# EAGLE design INV_1_0 (EAGLE 8.3.2)
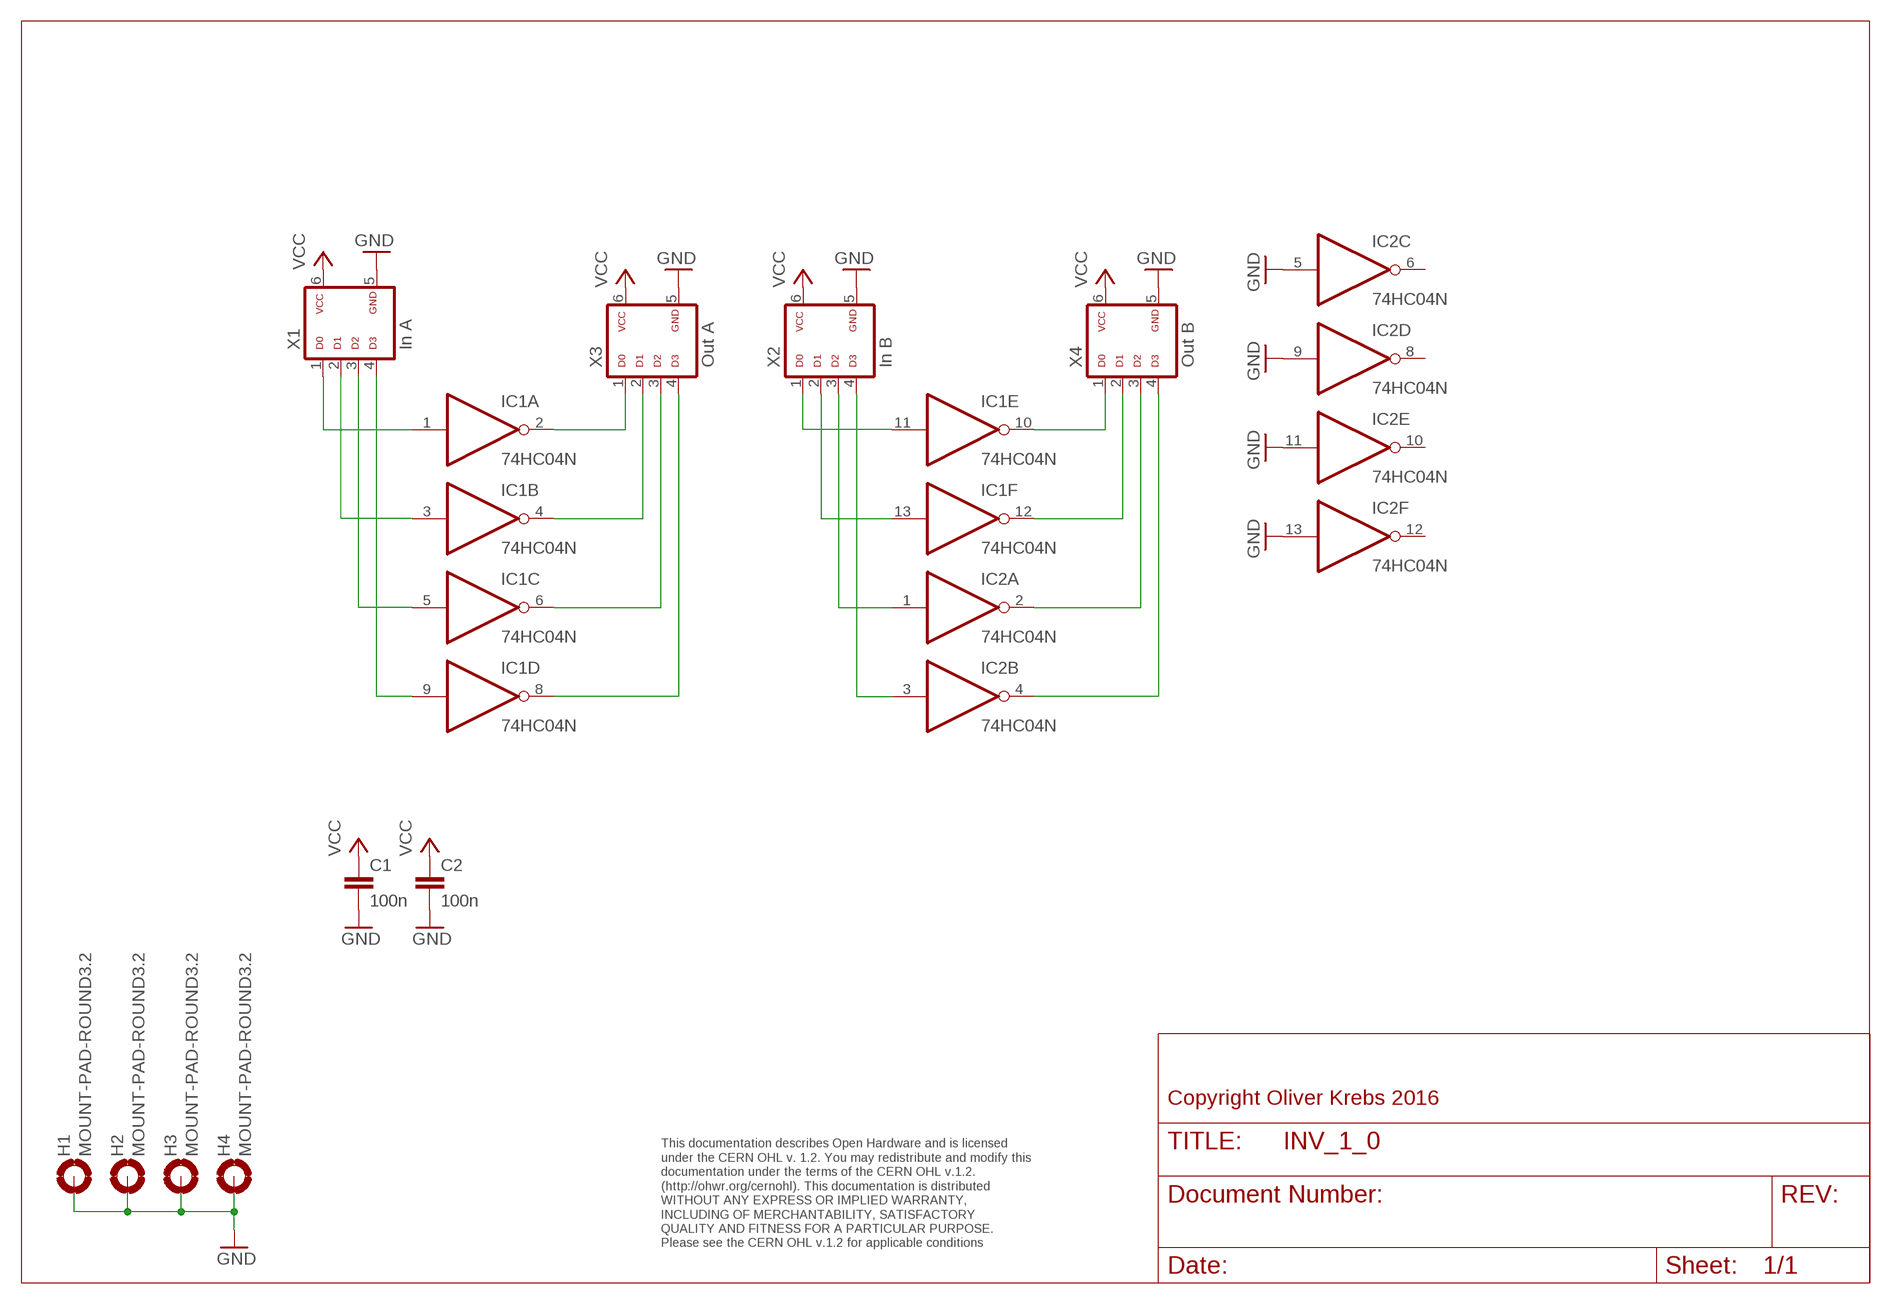
[diagram p0: schematic, sheet 1]

## Parts
C1  100n  C-EU050-025X075  [C050-025X075]
C2  100n  C-EU050-025X075  [C050-025X075]
H1  MOUNT-PAD-ROUND3.2  [3,2-PAD]
H2  MOUNT-PAD-ROUND3.2  [3,2-PAD]
H3  MOUNT-PAD-ROUND3.2  [3,2-PAD]
H4  MOUNT-PAD-ROUND3.2  [3,2-PAD]
IC1  74HC04N  [DIL14]
IC2  74HC04N  [DIL14]
X1  In A  ML6D  [ML-6]
X2  In B  ML6D  [ML-6]
X3  Out A  ML6D  [ML-6]
X4  Out B  ML6D  [ML-6]

## Nets
GND: C1.2 C2.2 H1.B3,2(MOUNT) H2.B3,2(MOUNT) H3.B3,2(MOUNT) H4.B3,2(MOUNT) IC2.5(C:I) IC2.9(D:I) IC2.11(E:I) IC2.13(F:I) X1.5 X2.5 X3.5 X4.5
N$4: IC1.8(D:O) X3.4
N$5: IC1.10(E:O) X4.1
N$6: IC1.12(F:O) X4.2
N$7: IC2.2(A:O) X4.3
N$8: IC2.4(B:O) X4.4
N$9: IC1.1(A:I) X1.1
N$10: IC1.11(E:I) X2.1
N$11: IC1.13(F:I) X2.2
N$12: IC1.3(B:I) X1.2
N$13: IC1.5(C:I) X1.3
N$14: IC2.1(A:I) X2.3
N$15: IC1.9(D:I) X1.4
N$16: IC2.3(B:I) X2.4
N$17: IC1.2(A:O) X3.1
N$18: IC1.4(B:O) X3.2
N$19: IC1.6(C:O) X3.3
VCC: C1.1 C2.1 X1.6 X2.6 X3.6 X4.6
Unconnected: IC2.6(C:O) IC2.8(D:O) IC2.10(E:O) IC2.12(F:O)

## Notes on the sheet
- Copyright Oliver Krebs 2016
- This documentation describes Open Hardware and is licensed 
  under the CERN OHL v. 1.2. You may redistribute and modify this 
  documentation under the terms of the CERN OHL v.1.2. 
  (http://ohwr.org/cernohl). This documentation is distributed
  WITHOUT ANY EXPRESS OR IMPLIED WARRANTY, 
  INCLUDING OF MERCHANTABILITY, SATISFACTORY 
  QUALITY AND FITNESS FOR A PARTICULAR PURPOSE. 
  Please see the CERN OHL v.1.2 for applicable conditions

## Power pins joined to a net without a drawn wire
GND: IC1.7(P:GND) IC2.7(P:GND)
VCC: IC1.14(P:VCC) IC2.14(P:VCC)

## Library data of the parts
C1 C2 = 01-my_rcl:C-EU: CAPACITOR, European symbol
H1-H4 = holes:MOUNT-PAD-ROUND: MOUNTING PAD, round
IC1 IC2 = 74xx-eu:74*04: Hex INVERTER
X1-X4 = 01-my-con:ML6D

## Board
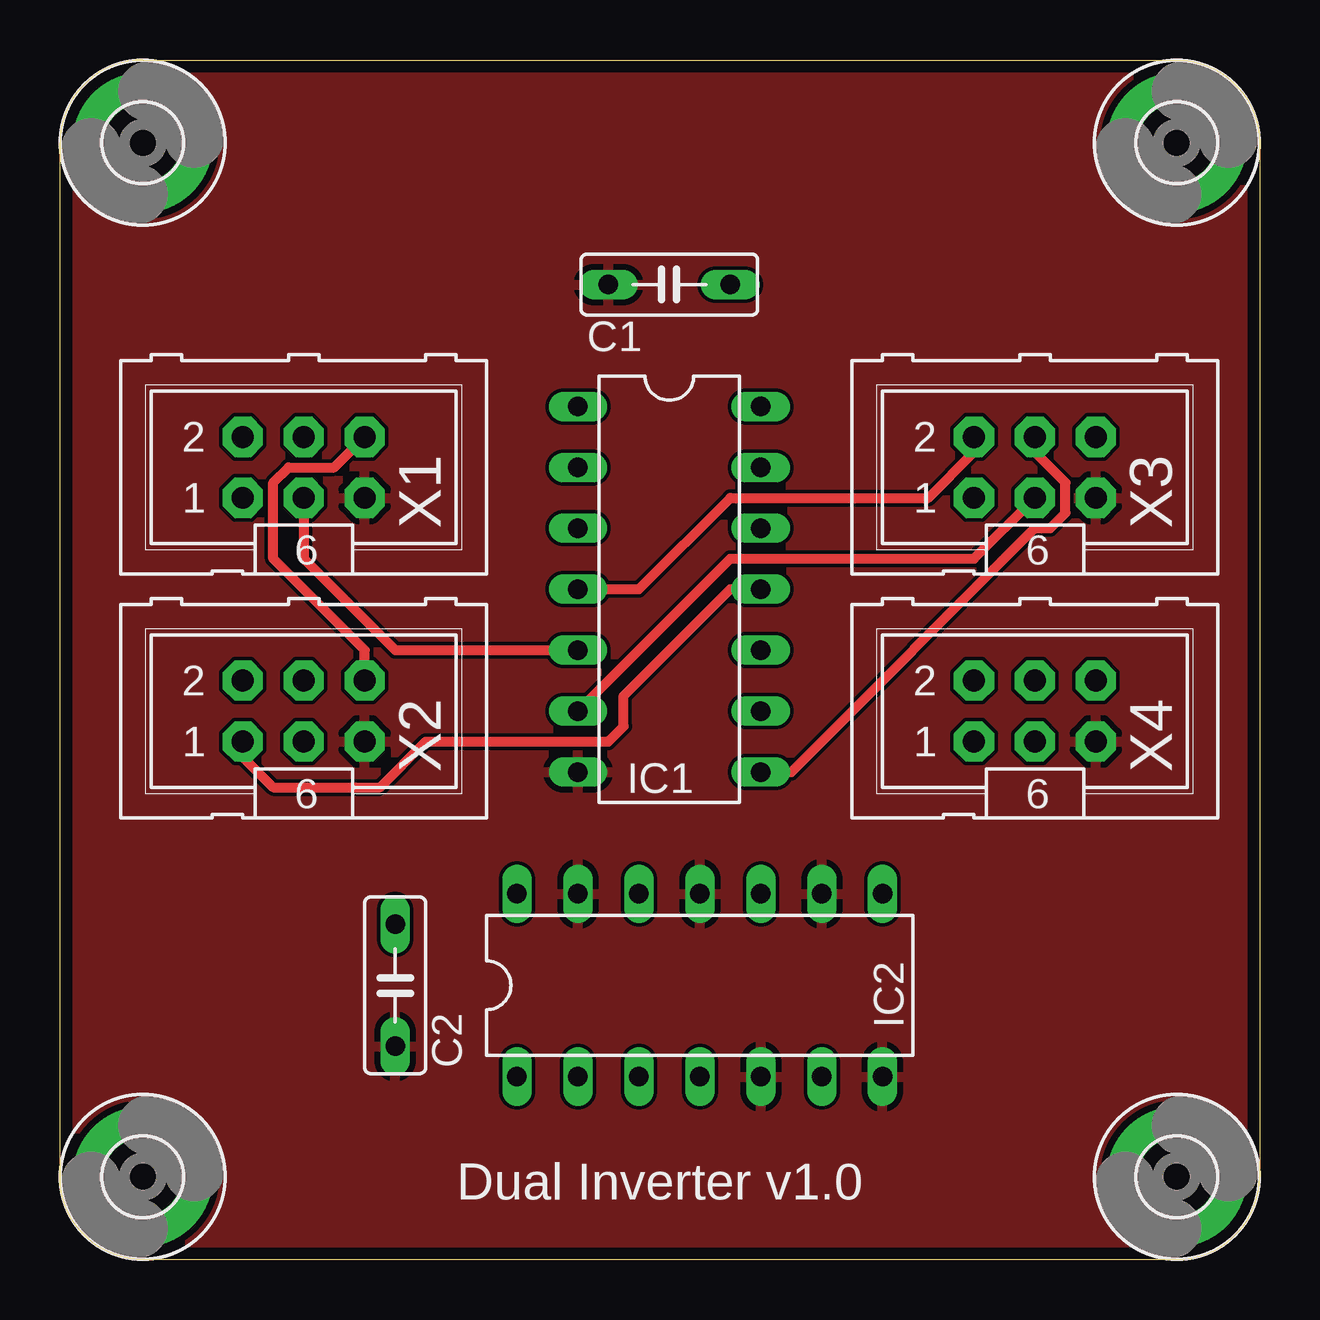
[diagram p1: board, top side]
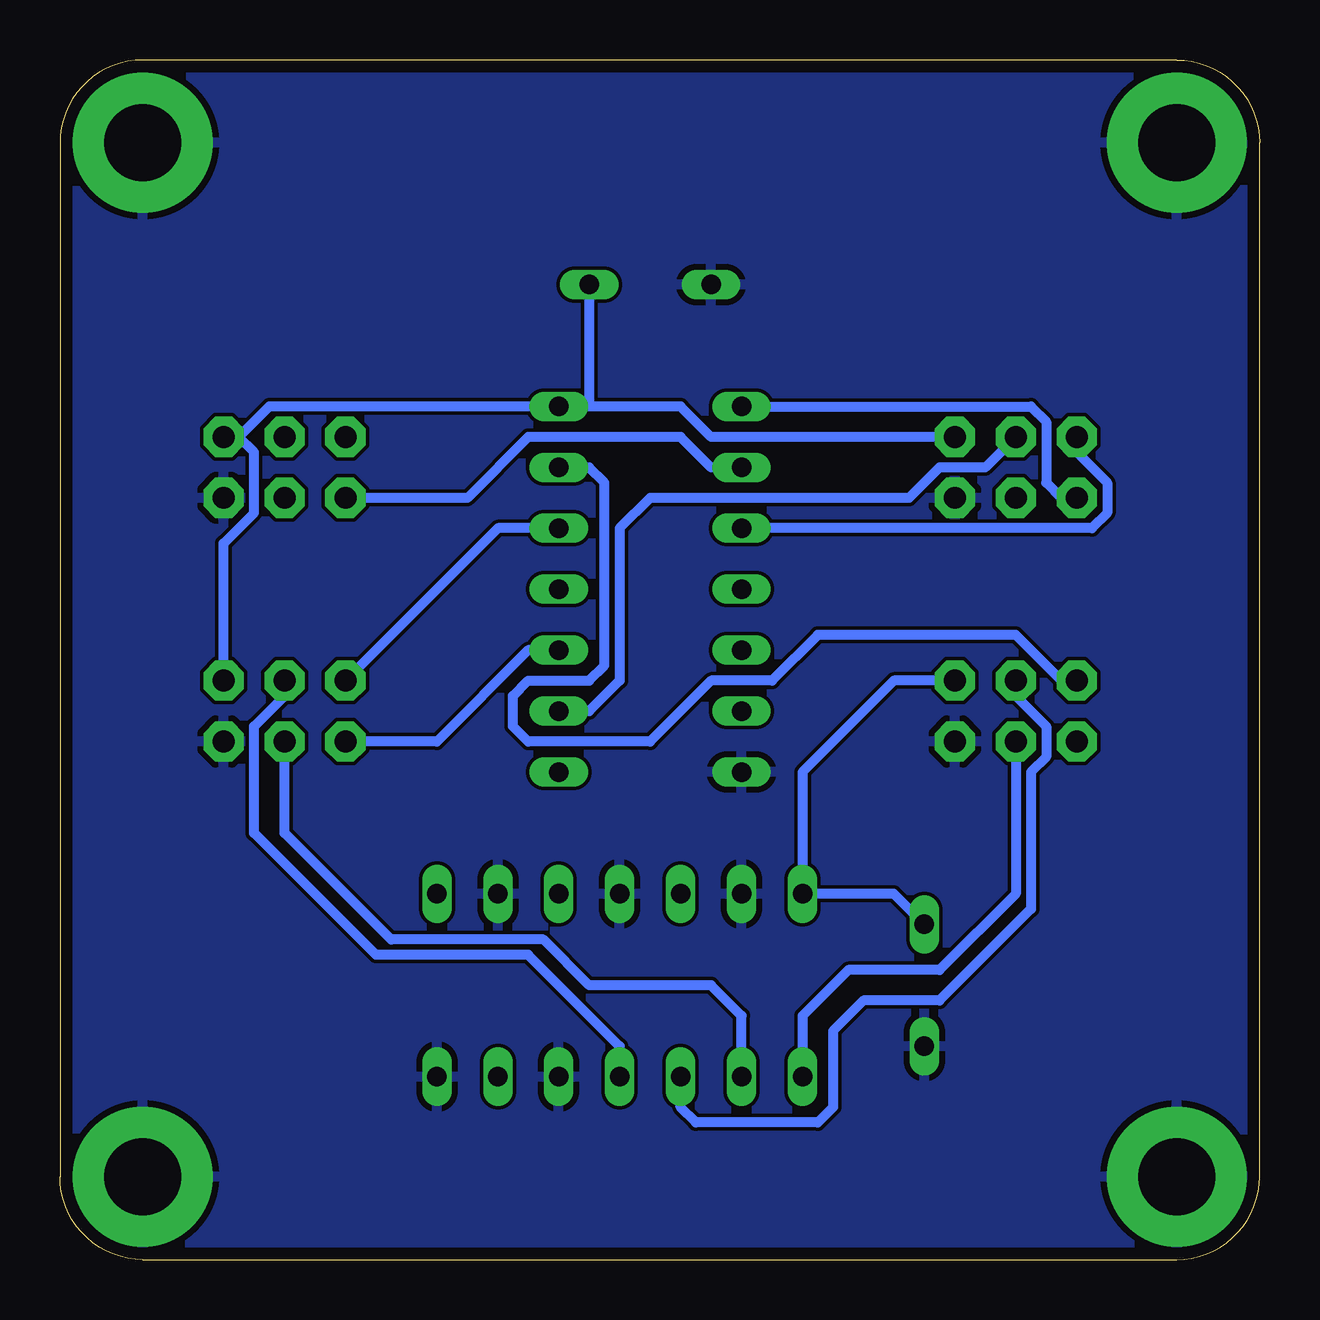
[diagram p2: board, bottom side, seen from below]

Size 50 x 50 mm. Coordinates in mm from the lower left corner, seen from the top.
Outline: 0,3.45 0,46.55 arc-90 3.45,50 46.55,50 arc-90 50,46.55 50,3.45 arc-90 46.55,0 3.45,0 arc-90 0,3.45
Copper layers (1*16): Top 0.035mm / dielectric 1.6mm / Bottom 0.035mm
Design rules "Elecrow_2-layer_PCB_eagle_rule": minimum track width 6mil, minimum drill 12mil, track to track 6mil, track to pad 6mil, pad to pad 6mil, via to via 8mil, smd to smd 0mil, copper to edge 20mil, drill to drill 10mil, minimum pad ring 6mil, minimum via ring 6mil, stop-mask expansion 0mil, vias tented up to drill 100mil, thermal gap 10mil

### Footprints (pad centres in the part's own frame; a part is rotated, then mirrored left to right if it is on the bottom)
C050-025X075 = drill 0.813 long: 1 -2.54,0; 2 2.54,0
3,2-PAD = drill 3.2 pad 5.842: B3,2 0,0
DIL14 = drill 0.813 long: 1 -7.62,-3.81; 2 -5.08,-3.81; 3 -2.54,-3.81; 4 0,-3.81; 5 2.54,-3.81; 6 5.08,-3.81; 7 7.62,-3.81; 8 7.62,3.81; 9 5.08,3.81; 10 2.54,3.81; 11 0,3.81; 12 -2.54,3.81; 13 -5.08,3.81; 14 -7.62,3.81
ML-6 = drill 0.914 pad 1.676 octagon: 1 -2.54,-1.27; 2 -2.54,1.27; 3 0,-1.27; 4 0,1.27; 5 2.54,-1.27; 6 2.54,1.27

### Placement (x,y rotation side)
C1  25.4,40.64 180 top
C2  13.97,11.43 270 top
H1  3.45,3.45 0 top
H2  3.45,46.55 0 top
H3  46.55,3.45 0 top
H4  46.55,46.55 0 top
IC1  25.4,27.94 270 top
IC2  26.67,11.43 0 top
X1  10.16,33.02 0 top
X2  10.16,22.86 0 top
X3  40.64,33.02 0 top
X4  40.64,22.86 0 top

### Tracks (layer width: path | path; a pad name or v marks a point on that pad's centre or on a via)
GND
  pour Bottom: 0,50.16 50.8,50.16 50.8,0 0,0
  pour Top: 0,50.16 50.8,50.16 50.8,0 0,0
N$4
  Top 0.406: IC1.8 30.48,20.32 40.64,30.48 41.27,30.48 41.91,31.11 41.91,32.38 40.64,33.66 X3.4
N$5
  Bottom 0.406: IC1.10 30.48,25.4 34.29,21.59 X4.1
N$6
  Bottom 0.406: IC1.12 31.75,30.48 X4.2
N$7
  Bottom 0.406: IC2.2 21.59,10.16 22.86,11.43 27.94,11.43 29.84,13.34 36.2,13.34 40.64,17.78 X4.3
N$8
  Bottom 0.406: IC2.4 26.67,8.89 30.48,12.7 36.83,12.7 41.91,17.78 41.91,22.23 40.64,23.5 X4.4
N$9
  Bottom 0.406: IC1.1 9.53,35.56 8.89,34.92 8.89,32.38 8.26,31.75 X1.1
N$10
  Top 0.406: X2.1 7.62,20.95 8.89,19.68 13.34,19.68 15.24,21.59 22.86,21.59 23.5,22.23 23.5,23.5 27.94,27.94 IC1.11
N$11
  Bottom 0.406: X2.2 8.26,24.13 10.16,26.04 18.41,26.04 20.32,24.13 22.86,24.13 25.4,21.59 30.48,21.59 31.11,22.23 31.11,23.5 30.48,24.13 27.94,24.13 27.3,24.77 27.3,32.38 27.94,33.02 IC1.13
N$12
  Bottom 0.406: X1.2 7.62,33.66 6.35,32.38 6.35,31.11 6.99,30.48 IC1.3
N$13
  Top 0.406: X1.3 10.16,29.21 13.97,25.4 IC1.5
N$14
  Bottom 0.406: X2.3 10.16,15.24 13.34,12.06 17.14,12.06 19.05,10.16 IC2.1
N$15
  Bottom 0.406: X1.4 11.43,33.02 13.34,33.02 14.61,31.75 25.4,31.75 26.67,30.48 26.67,24.13 27.94,22.86 IC1.9
N$16
  Bottom 0.406: X2.4 10.16,23.5 8.89,22.23 8.89,20.95 9.53,20.32 9.53,14.61 13.34,10.79 16.51,10.79 17.78,9.53 17.78,6.35 18.41,5.71 23.5,5.71 24.13,6.35 IC2.3
N$17
  Bottom 0.406: IC1.2 22.86,33.02 24.13,34.29 30.48,34.29 33.02,31.75 X3.1
N$18
  Top 0.406: IC1.4 24.13,27.94 27.94,31.75 36.2,31.75 38.1,33.66 X3.2
N$19
  Top 0.406: IC1.6 27.94,29.21 38.1,29.21 X3.3
VCC
  Top 0.406: X2.6 12.7,25.4 8.89,29.21 8.89,32.38 9.53,33.02 11.43,33.02 X1.6
  Bottom 0.406: X1.6 22.86,34.29 24.13,35.56 27.94,35.56 | 27.94,35.56 IC1.14 41.27,35.56 42.55,34.29 | 42.55,34.29 X3.6 | X4.6 43.18,29.84 41.91,31.11 41.91,33.66 42.55,34.29 | X2.6 15.24,24.13 19.05,20.32 IC2.14 15.24,15.24 C2.1 | C1.1 27.94,35.56

### Text on the board
tNames: Dual Inverter v1.0
200bmp: E:/Bilder/Elektronik/Modulion/Mexdulon/mexdulon_50x50_pcb.bmp